# EasyEDA Pro project ProDocument_PCB2_2024-05-04.epro

# Board PCB2
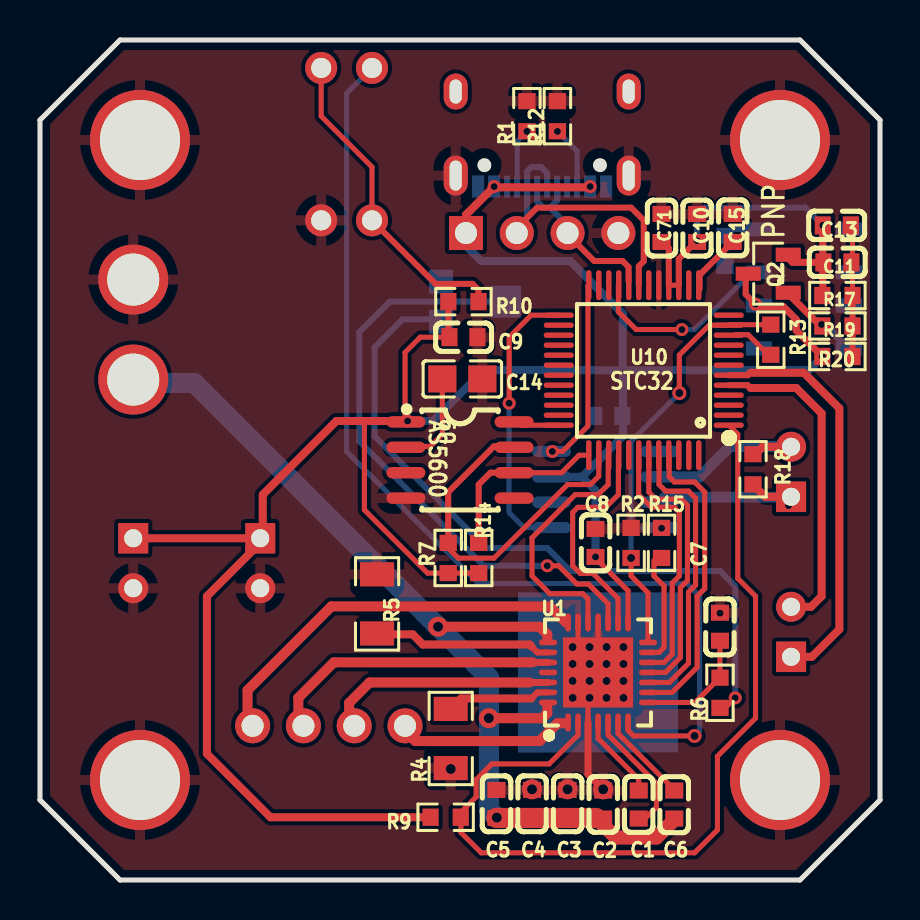
[diagram p0: board, top side]
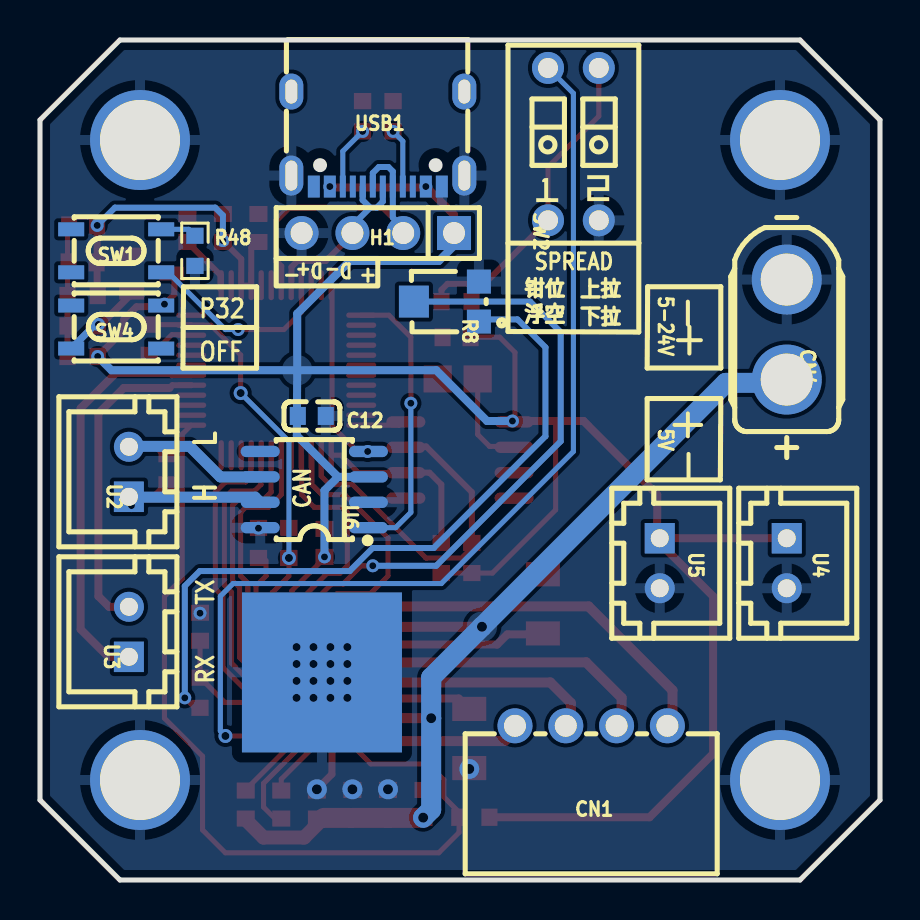
[diagram p1: board, bottom side, seen from below]

Outline 42 x 42 mm; copper layers: Top Layer, Bottom Layer. Coordinates in mm from the lower left corner of the outline.
Outline path: 0,38 0,4 4,0 38,0 42,4 42,38 38,42 4,42 0,38
Stack: Top Layer 0.035mm / Dielectric1 1.51mm FR4 er 4.5 / Bottom Layer 0.035mm

## Design rules (mm)
spacing safeClearance (default): track to track 0.152, other pairs 0.152 to 0.3
track width trackWidth (default): min 0.127, default 0.254, max 2.54
differential pair differentialPair (default): width min 0.127, default 0.254, max 2.54; gap min 0.152, default 0.152
via viaSize (default): diameter min 0.5, default 0.61, max 10; hole min 0.3, default 0.305, max 6

## Placement (name value [footprint] x y rotation side)
C1  22nF  [C0603]  29.94 3.77 270 top
C2  4.7uF  [C0603]  28.16 3.77 270 top
C3  4.7uF  [C0603]  26.38 3.8 270 top
C4  100nF  [C0603]  24.6 3.8 270 top
C5  100nF  [C0603]  22.82 3.8 270 top
C6  100nF  [C0603]  31.71 3.77 90 top
C7  4.7uF  [C0603]  34 12.66 90 top
C8  100nF  [C0603]  27.78 16.85 270 top
C9  100nF  [C0603]  21.17 27.14 180 top
C10  100nF  [C0603]  32.86 32.6 90 top
C11  22uF  [C0603]  39.87 30.88 0 top
C12  100nF  [C0603]  28.41 23.2 0 bottom
C13  0.1uF  [C0603]  39.84 32.73 0 top
C14  1uF  [C0805]  21.12 25.05 0 top
C15  10uF  [C0603]  34.63 32.6 270 top
C71  10uF  [C0603]  31.08 32.6 90 top
CN1  XH-4AW  [CONN-TH_XH-4AW]  14.44 7.71 180 bottom
CN4  XT30UPB-F30.G.Y  [CONN-TH_XT30UPB-F]  4.66 27.52 90 bottom
H1  PZ254V-11-04P  [HDR-TH_4P-P2.54-V-M]  25.11 32.35 0 bottom
NOREF  -  [Pad_e147]  37 37 180 top
NOREF#2  -  [Pad_e2045]  27.9 10.38 180 top
NOREF#3  -  [Pad_e149]  5 5 180 top
NOREF#4  -  [Pad_e150]  37 5 180 top
NOREF#5  -  [Pad_e148]  5 37 180 top
Q2  S8550  [SOT-23-3_L2.9-W1.3-P1.90-LS2.4-BR]  36.41 30.32 0 top
R1  5.1K  [R0603]  24.35 38.19 90 top
R2  10K  [R0603]  29.55 16.85 270 top
R4  0.1R  [R1206]  20.54 7.08 270 top
R5  0.1R  [R1206]  16.85 13.81 90 top
R6  10K  [R0603]  34 9.36 90 top
R7  10K  [R0603]  20.41 16.1 270 top
R8  10kΩ  [RES-ADJ-SMD_3P-L3.0-W3.8-P1.75-BR]  21.68 28.92 180 bottom
R9  10K  [R0603]  20.28 3.14 0 top
R10  10K  [R0603]  21.17 28.92 0 top
R12  5.1K  [R0603]  25.87 38.19 90 top
R13  1K  [R0603]  36.54 27.01 270 top
R14  10K  [R0603]  21.93 16.1 270 top
R15  10K  [R0603]  31.08 16.85 270 top
R17  1kΩ  [R0603]  39.87 29.22 180 top
R18  120Ω  [R0603]  35.65 20.54 270 top
R19  1kΩ  [R0603]  39.87 27.7 180 top
R20  5.1K  [R0603]  39.87 26.18 180 top
R48  1kΩ  [R0603]  34.25 31.46 90 bottom
SW1  TS-1089S-02526  [SW-SMD_4P-L4.2-W3.3-P2.15-LS5.1]  38.19 31.46 180 bottom
SW2  DS1040-02BN  [KEY-TH_DS1040-02BN]  15.33 36.79 180 bottom
SW4  TS-1089S-02526  [SW-SMD_4P-L4.2-W3.3-P2.15-LS5.1]  38.19 27.65 0 bottom
U1  TMC2209-LA  [QFN-28_L5.0-W5.0-P0.50-BL-EP]  27.9 10.38 0 top
U2  HC-XH-2A-G  [CONN-TH_2P-P2.50_HC-XH-2A-G]  37.56 20.41 90 bottom
U3  HC-XH-2A-G  [CONN-TH_2P-P2.50_HC-XH-2A-G]  37.56 12.41 90 bottom
U4  HC-XH-2A-G  [CONN-TH_2P-P2.50_HC-XH-2A-G]  4.66 15.84 270 bottom
U5  HC-XH-2A-G  [CONN-TH_2P-P2.50_HC-XH-2A-G]  11.01 15.84 270 bottom
U6  TJA1050T/CM,118  [SOIC-8_L5.0-W4.0-P1.27-LS6.0-BL]  28.28 19.52 90 bottom
U9  AS5600-ASOT  [SOIC-8_L5.0-W4.0-P1.27-LS6.0-BL]  21 21 270 top
U10  STC32G12K128-35I-LQFP48  [LQFP-48_L7.0-W7.0-P0.50-LS9.0-BL]  30.19 25.49 90 top
USB1  TYPE-C 16PIN 2MD(073)  [USB-C-SMD_TYPE-C-6PIN-2MD-073]  25.11 37.05 0 bottom

## Footprints (pads in the part's own frame, mm; a bottom-side part is the same pattern mirrored in y, then rotated)
C0603
  rect 0.8x0.9 smd: 1(-0.7,0) 2(0.7,0)
C0805
  rect 1.41x1.35 smd: 1(-1,0) 2(1,0)
CONN-TH_2P-P2.50_HC-XH-2A-G
  rect 1.524x1.5 hole 0.9: 1(-1.25,0)
  round 1.5 hole 0.9: 2(1.25,0)
CONN-TH_XH-4AW
  round 1.75 hole 1.1: 1(-3.81,0) 2(-1.27,0) 3(1.27,0) 4(3.81,0)
CONN-TH_XT30UPB-F
  round 3.5 hole 2.6: 1(-2.5,0) 2(2.5,0)
HDR-TH_4P-P2.54-V-M
  rect 1.7x1.7 hole 1.1: 1(-3.81,0)
  round 1.7 hole 1.1: 2(-1.27,0) 3(1.27,0) 4(3.81,0)
KEY-TH_DS1040-02BN
  round 1.6 hole 1: 1(-1.27,-3.81) 2(1.27,-3.81) 3(1.27,3.81) 4(-1.27,3.81)
LQFP-48_L7.0-W7.0-P0.50-LS9.0-BL
  oval 0.27x1.5 smd: 1(-2.75,-4.25) 2(-2.25,-4.25) 3(-1.75,-4.25) 4(-1.25,-4.25) 5(-0.75,-4.25) 6(-0.25,-4.25) 7(0.25,-4.25) 8(0.75,-4.25) 9(1.25,-4.25) 10(1.75,-4.25) 11(2.25,-4.25) 12(2.75,-4.25) 25(2.75,4.25) 26(2.25,4.25) 27(1.75,4.25) 28(1.25,4.25) 29(0.75,4.25) 30(0.25,4.25) 31(-0.25,4.25) 32(-0.75,4.25) 33(-1.25,4.25) 34(-1.75,4.25) 35(-2.25,4.25) 36(-2.75,4.25)
  oval 1.5x0.27 smd: 13(4.25,-2.75) 14(4.25,-2.25) 15(4.25,-1.75) 16(4.25,-1.25) 17(4.25,-0.75) 18(4.25,-0.25) 19(4.25,0.25) 20(4.25,0.75) 21(4.25,1.25) 22(4.25,1.75) 23(4.25,2.25) 24(4.25,2.75) 37(-4.25,2.75) 38(-4.25,2.25) 39(-4.25,1.75) 40(-4.25,1.25) 41(-4.25,0.75) 42(-4.25,0.25) 43(-4.25,-0.25) 44(-4.25,-0.75) 45(-4.25,-1.25) 46(-4.25,-1.75) 47(-4.25,-2.25) 48(-4.25,-2.75)
Pad_e147
  round 5 hole 4: 1(0,0)
Pad_e148
  round 5 hole 4: 2(0,0)
Pad_e149
  round 5 hole 4: 3(0,0)
Pad_e150
  round 5 hole 4: 4(0,0)
Pad_e2045
  rect 8x8 smd far side: 1(0,0)
QFN-28_L5.0-W5.0-P0.50-BL-EP
  oval 0.28x0.9 smd: 1(-1.502,-2.5) 2(-1.001,-2.5) 3(-0.5,-2.5) 4(0,-2.5) 5(0.5,-2.5) 6(1,-2.5) 7(1.501,-2.5) 15(1.501,2.5) 16(1,2.5) 17(0.5,2.5) 18(0,2.5) 19(-0.5,2.5) 20(-1.001,2.5) 21(-1.502,2.5)
  oval 0.9x0.28 smd: 8(2.5,-1.502) 9(2.5,-1.001) 10(2.5,-0.5) 11(2.5,0) 12(2.5,0.5) 13(2.5,1) 14(2.5,1.501) 22(-2.5,1.501) 23(-2.5,1) 24(-2.5,0.5) 25(-2.5,0) 26(-2.5,-0.5) 27(-2.5,-1.001) 28(-2.5,-1.502)
  rect 3.5x3.5 smd: 29(0,0)
R0603
  rect 0.806x0.864 smd: 1(-0.753,0) 2(0.753,0)
R1206
  rect 1.208x1.701 smd: 1(-1.479,0) 2(1.479,0)
RES-ADJ-SMD_3P-L3.0-W3.8-P1.75-BR
  rect 1.2x1.2 smd: 1(1.625,-1) 3(1.625,1)
  rect 1.5x1.6 smd: 2(-1.625,0)
SOIC-8_L5.0-W4.0-P1.27-LS6.0-BL
  oval 0.569x1.95 smd: 1(-1.905,-2.705) 2(-0.635,-2.705) 3(0.635,-2.705) 4(1.905,-2.705) 5(1.905,2.705) 6(0.635,2.705) 7(-0.635,2.705) 8(-1.905,2.705)
SOT-23-3_L2.9-W1.3-P1.90-LS2.4-BR
  rect 1.25x0.7 smd: 1(1,-0.95) 2(1,0.95) 3(-1,0)
SW-SMD_4P-L4.2-W3.3-P2.15-LS5.1
  rect 1.3x0.7 smd: 1(-2.25,1.075) 2(2.25,1.075) 3(-2.25,-1.075) 4(2.25,-1.075)
USB-C-SMD_TYPE-C-6PIN-2MD-073
  rect 0.6x1.1 smd: 1(-3.2,2.375) 2(-2.4,2.375) 11(2.4,2.375) 12(3.2,2.375)
  rect 0.3x1.1 smd: 3(-1.75,2.375) 4(-1.25,2.375) 5(-0.75,2.375) 6(-0.25,2.375) 7(0.25,2.375) 8(0.75,2.375) 9(1.25,2.375) 10(1.75,2.375)
  oval 1.2x1.8 hole 0.6x1.2: 13(-4.325,-2.375) 14(4.325,-2.375)
  oval 1.2x2 hole 0.6x1.5: 13(-4.325,1.825) 14(4.325,1.825)

## Nets
5V: C8.2 C9.2 C12.2 H1.1 Q2.3 R7.2 R9.1 R10.1 R14.2 R20.2 SW4.3 U1.15 U4.1 U5.1 U6.3 U9.1 USB1.2 USB1.11
5VOUT: C7.1 R6.2 U1.8
GND: C2.1 C3.1 C4.1 C5.1 C7.2 C8.1 C9.1 C10.2 C12.1 C14.2 C15.1 C71.2 CN4.2 H1.4 NOREF.1 NOREF#2.1 NOREF#3.3 NOREF#4.4 NOREF#5.2 R1.2 R2.1 R4.2 R5.2 R8.3 R12.2 R15.1 R48.1 SW2.2 U1.3 U1.18 U1.20 U1.29 U4.2 U5.2 U6.2 U6.8 U9.4 U10.17 USB1.1 USB1.12 USB1.13 USB1.14
A1: CN1.3 U1.24
A2: CN1.4 U1.21
AS5600_DIR: U9.8 U10.36
AS5600_SCL: R7.1 U9.7 U10.38
AS5600_SDA: R14.1 U9.6 U10.37
B1: CN1.2 U1.26
B2: CN1.1 U1.1
CANH: R18.2 U2.1 U6.7
CANL: R18.1 U2.2 U6.6
CANRX: U6.4 U10.24
CANTX: U6.1 U10.25
D+: H1.3 U10.20 USB1.6 USB1.8
D-: H1.2 U10.19 USB1.5 USB1.7
DIAG: U1.11 U10.43
DIR: U1.19 U10.39
EN: R9.2 U1.2 U10.1
INDEX: U1.12 U10.42
MS1: U1.9 U10.45
MS2: U1.10 U10.44
SPREAD: SW2.4 U1.7
STC_VCC: C10.1 C11.1 C13.1 C71.1 Q2.2 R17.2 U10.15 U10.16
STEP: U1.16 U10.40
TMC2209_RX: R2.2 R13.1 U1.14 U10.11
TMC2209_TX: R13.2 U10.10
UART2_RX: U3.2 U10.5
UART2_TX: U3.1 U10.6
VCP: C6.2 U1.6
VM: C2.2 C3.2 C4.2 C5.2 C6.1 CN4.1 U1.22 U1.28
$1N1664: R4.1 U1.27
$1N1667: R5.1 U1.23
$1N1679: R6.1 R8.1
$1N1684: C1.1 U1.4
$1N1687: C1.2 U1.5
$1N1724: R15.2 U1.13
$1N1728: R8.2 U1.17
$1N7809: R10.2 SW2.1 SW2.3
$1N13583: R1.1 USB1.4
$1N13638: R12.1 USB1.10
$1N18653: R48.2 SW1.2
$1N20613: Q2.1 R19.2 SW4.2
$1N20840: C11.2 C13.2 R17.1 R19.1 R20.1
$1N22704: C14.1 U9.2
$1N38726: C15.2 U10.13
$1N69835: SW1.4 U10.21

Pads without a net: SW1 1 3; SW4 1 4; U1 25; U6 5; U9 3 5; U10 2 3 4 7 8 9 12 14 18 22 23 26 27 28 29 30 31 32 33 34 35 41 46 47 48; USB1 3 9

## Via types
v1: diameter 0.7, hole 0.4, Top Layer to Bottom Layer, 19 vias
v2: diameter 0.65, hole 0.35, Top Layer to Bottom Layer, 19 vias
v3: diameter 1, hole 0.5, Top Layer to Bottom Layer, 7 vias

## Routing (per net, layer and track width the routed paths; a pad name or vN(x,y) marks a point on that pad's centre or on a via; arc(x,y) is an arc through that point)
5V: length 126.2
  Top Layer w0.254: v2(27.78,16.15) 27.71,16.09 27.78,16.09 29.4,14.46 U1.15 ; 20.41,15.33 20.43,15.35 R14.2 ; 18.25,22.91 18.25,26.38 19.01,27.14 C9.2 ; R7.2 19.38,15.35 16.22,18.5 16.22,22.95
  Top Layer w0.3: 35.29,30.32 35.29,29.28 v2(35.78,28.79) ; R10.1 20.42,27.19 C9.2
  Top Layer w0.35: v2(39.12,26.18) 37.81,27.48 37.81,28.03 37.17,28.67 35.9,28.67 v2(35.78,28.79)
  Top Layer w0.4: H1.1 21.3,33.26 v2(22.71,34.67) 22.75,34.63 27.47,34.63 v2(27.51,34.67) ; 11.14,16.98 11.03,17.09 U4.1 ; 11.14,16.98 11.14,19.27 14.82,22.95 v2(18.38,22.95) ; 11.14,16.98 8.35,14.19 8.35,6.31 11.52,3.14 R9.1
  Bottom Layer w0.4: v2(18.38,22.95) 19.65,22.95 22.19,25.49 29.14,25.49 ; 29.14,25.49 38.43,25.49 v2(39.12,26.18) ; 29.14,25.49 29.14,28.32 26.51,30.95 22.06,30.95 21.3,31.71 H1.1 ; 29.14,25.49 29.16,22.22 27.1,20.16 ; U6.3 27.1,20.16 ; 27.1,20.16 27.78,19.48 v2(27.78,16.15)
5VOUT: length 6
  Top Layer w0.254: C7.1 34,10.12 32.75,8.88 U1.8
GND: length 11.7
  Top Layer w0.254: 27.9,10.42 27.9,10.25 27.4,9.75 U1.3 ; 27.9,10.42 U1.18 ; 27.9,10.42 26.9,11.42 U1.20
  Top Layer w0.35: v3(28.16,4.53) 27.4,5.29 U1.3
  vias: v1(26.63,11.65) v1(26.63,10.8) v1(26.63,9.95) v1(26.63,9.11) v1(27.48,11.65) v1(27.48,10.8) v1(27.48,9.95) v1(27.48,9.11) v1(28.33,11.65) v1(28.33,10.8) v1(28.33,9.95) v1(28.33,9.11) v1(29.17,11.65) v1(29.17,10.8) v1(29.17,9.95) v1(29.17,9.11) v2(31.08,17.59) v2(34,13.34) v3(20.54,5.55) v3(24.6,4.53) v3(26.38,4.53)
A1: length 14.4
  Top Layer w0.35: U1.24 24.86,10.88
  Top Layer w0.5: 12.92,7.71 12.92,9.11 14.7,10.89 24.62,10.89
A2: length 19.8
  Top Layer w0.5: 26.29,12.88 25.49,13.68 14.57,13.68 10.38,9.49 10.38,7.71
AS5600_DIR: length 2.2
  Top Layer w0.254: U10.36 24.05,22.74 23.84,22.95
AS5600_SCL: length 17.5
  Top Layer w0.254: U10.38 27.94,20.19 27.52,19.78 26.38,19.78 22.7,16.09 20.92,16.09 20.41,16.6 R7.1
  Top Layer w0.3: R7.1 20.41,19.39 22.7,21.68 23.66,21.68 U9.7
AS5600_SDA: length 9
  Top Layer w0.254: 23.81,20.36 26.08,20.36 26.96,21.24 U10.37
  Top Layer w0.3: 23.81,20.36 22.52,20.36 21.93,19.78 R14.1
B1: length 11.5
  Top Layer w0.35: U1.26 24.47,9.88
  Top Layer w0.5: 24.47,9.88 16.48,9.88 15.46,8.85 15.46,7.71
B2: length 9
  Top Layer w0.35: 26.29,7.88 26.25,7.84
  Top Layer w0.5: 18,7.71 18.76,6.95 24.98,6.95 25.87,7.84 26.25,7.84
CANH: length 8.8
  Top Layer w0.4: 35.65,19.78 36.27,19.16 U2.1
  Bottom Layer w0.55: 30.99,18.89 31.24,19.14 37.54,19.14 U2.1
  vias: v2(37.43,18.72)
CANL: length 9.1
  Top Layer w0.4: 35.78,21.3 36.14,21.66 U2.2
  Bottom Layer w0.55: U2.2 37.54,21.68 34.51,21.68 32.98,20.16 30.99,20.16
CANRX: length 9.4
  Top Layer w0.254: U10.24 27.4,29.7 27.4,22.7 26.12,21.43 v2(25.62,21.43)
CANTX: length 14.1
  Top Layer w0.254: U10.25 24.56,28.24 23.46,27.14 v2(23.46,23.84)
  Bottom Layer w0.254: v2(23.46,23.84) 23.46,18.38 24.22,17.62 U6.1
D+: length 8.8
  Top Layer w0.3: 29.43,29.94 29.43,30.65 29.13,30.95 27.71,30.95 26.38,32.28 H1.3
  Bottom Layer w0.3: 25.49,33.62 25.87,34 25.87,34.63 ; 25.49,33.62 25.16,33.62 24.86,33.92 USB1.6 ; 25.49,33.62 26.38,32.73 H1.3
D-: length 15.8
  Top Layer w0.3: U10.19 29.94,30.69 30.19,30.94 30.19,32.98 29.55,33.62 24.86,33.62 23.84,32.6 23.84,32.35
  Bottom Layer w0.3: USB1.7 25.36,35.35 25.06,35.65 24.58,35.65 24.36,35.43 USB1.5 24.36,33.12 23.84,32.6 23.84,32.35
DIAG: length 13.7
  Top Layer w0.254: U1.11 31.27,10.38 32.02,11.12 32.02,14.62 32.37,14.97 32.37,18.73 32.07,19.04 30.8,19.04 30.44,19.39 30.44,21.24 U10.43
DIR: length 12.6
  Top Layer w0.254: U10.39 28.41,21.21 28.41,19.78 27.9,19.27 26.76,19.27 24.6,17.11 24.6,15.2 25.49,14.31 27.14,14.31 27.4,14.06 27.4,13.04
EN: length 44.9
  Top Layer w0.254: U10.1 34.89,22.29 34.89,15.08 35.78,14.19 35.78,8.09 33.87,6.19 33.87,2.5 32.73,1.36 22.06,1.36 21.05,2.38 21.05,3.13 ; 21.05,3.13 R9.2 ; 21.05,3.13 21.05,3.39 21.81,4.15 21.81,5.02 22.6,5.81 25.46,5.81 26.9,7.25 U1.2
INDEX: length 13
  Top Layer w0.254: U10.42 29.94,21.24 29.94,19.27 30.57,18.63 31.71,18.63 31.97,18.38 31.97,15.2 31.61,14.85 31.61,11.29 31.2,10.88 U1.12
MS1: length 15.1
  Top Layer w0.254: U1.9 31.6,9.38 32.86,10.63 32.86,14.19 33.24,14.57 33.24,19.39 32.73,19.9 31.71,19.9 31.46,20.16 31.46,21.22 U10.45
MS2: length 14.4
  Top Layer w0.254: U10.44 30.95,21.23 30.95,19.78 31.28,19.44 32.42,19.44 32.78,19.09 32.78,14.75 32.42,14.39 32.42,10.83 31.47,9.88 U1.10
SPREAD: length 51.3
  Top Layer w0.254: U1.7 29.4,7.48 29.68,7.2 v1(32.73,7.2)
  Bottom Layer w0.254: SW2.4 15.33,39.33 15.33,21.43 21.93,14.82 32.35,14.82 32.98,14.19 32.98,7.46 v1(32.73,7.2)
STC_VCC: length 19.1
  Top Layer w0.254: U10.16 U10.15
  Top Layer w0.3: v2(32.86,31.97) 31.94,31.05 U10.15 ; 31.08,31.97 31.44,31.61 U10.16
  Top Layer w0.35: v2(39.14,32.73) 39.14,30.88 ; 39.14,30.88 37.63,30.88 37.3,31.2 ; 39.14,30.88 39.14,29.23 39.08,29.17
  Bottom Layer w0.3: v2(39.14,32.73) 38.25,33.62 33.24,33.62 32.86,33.24 v2(32.86,31.97)
STEP: length 11.4
  Top Layer w0.254: U10.40 28.92,21.22 28.92,19.27 28.28,18.63 26.89,18.63 26.63,18.38 26.63,15.71 27.01,15.33 27.65,15.33 28.9,14.08 U1.16
TMC2209_RX: length 20.8
  Top Layer w0.254: v1(31.97,24.35) 31.97,26.25 33.46,27.74 U10.11 34.47,27.77 36.41,27.77 ; U1.14 30.4,14.35 29.55,15.2 v1(29.55,16.1)
  Bottom Layer w0.254: v1(29.55,16.1) 29.55,21.93 v1(31.97,24.35)
TMC2209_TX: length 2.1
  Top Layer w0.254: 34.76,27.27 35.4,27.27 36.41,26.26
UART2_RX: length 16.1
  Top Layer w0.3: 35.52,24.6 35.38,24.74 U10.5
  Top Layer w0.4: 35.52,24.6 37.81,24.6 39.08,23.33 39.08,14.19 38.55,13.66 U3.2
UART2_TX: length 20.3
  Top Layer w0.3: U10.6 35.4,25.24 35.52,25.36
  Top Layer w0.4: 35.52,25.36 38.19,25.36 39.97,23.58 39.97,12.54 38.59,11.16 U3.1
VCP: length 4.5
  Top Layer w0.254: 31.71,4.52 28.9,7.32 U1.6
VM: length 50.2
  Top Layer w0.35: 25.36,8.84 25.36,8.73 ; 25.36,11.92 25.36,12.03
  Top Layer w0.5: 25.36,12.03 25.36,12.28 24.98,12.66 v3(19.9,12.66) ; v3(22.44,8.09) 25.11,8.09 25.36,8.34 25.36,8.73
  Top Layer w0.7: 27.81,3.1 28.79,2.12 30.82,2.12 31.78,3.07
  Top Layer w1: C3.2 C4.2 C5.2 ; 26.51,3.1 27.81,3.1
  Bottom Layer w1: v3(22.84,3.12) 22.44,3.52 v3(22.44,8.09) 22.44,10.12 v3(19.9,12.66) 7.71,24.86 4.83,24.86 CN4.1
$1N1664: length 5.2
  Top Layer w0.3: 24.57,9.08 24.87,9.38 U1.27
  Top Layer w0.4: 24.57,9.08 21.06,9.08 R4.1
$1N1667: length 8.9
  Top Layer w0.3: 24.57,11.68 24.87,11.38 U1.23
  Top Layer w0.4: 24.57,11.68 24.47,11.77 19.14,11.77 18.63,12.28 16.9,12.28 R5.1
$1N1679: length 36.1
  Top Layer w0.254: R6.1 34.26,8.61 v2(34.76,9.11)
  Bottom Layer w0.3: R8.1 19.94,28.03 18.12,28.03 16.73,26.63 16.73,22.19 22.32,16.6 25.36,16.6 26.52,15.45 34.01,15.45 34.76,14.69 v2(34.76,9.11)
$1N1684: length 4.3
  Top Layer w0.254: 27.9,7.96 27.9,7.08 29.94,5.04 C1.1
$1N1687: length 6.4
  Top Layer w0.254: U1.5 28.4,7.25 30.82,4.83 30.82,3.65 30.25,3.07 C1.2
$1N1724: length 5.5
  Top Layer w0.254: 30.7,15.97 30.7,15.2 31.21,14.69 31.21,11.63 30.95,11.38 U1.13
$1N1728: length 30.2
  Top Layer w0.254: U1.17 28.4,13.81 27.42,14.8 26.85,14.8 25.93,15.71 v2(25.36,15.71)
  Bottom Layer w0.3: v2(25.36,15.71) 22.19,15.71 15.97,21.93 15.97,27.39 17.49,28.92 R8.2
$1N7809: length 16
  Top Layer w0.254: SW2.1 16.6,35.65 14.06,38.19 SW2.3
  Top Layer w0.3: R10.2 21.93,29.51 21.63,29.81 19.78,29.81 SW2.1
$1N13583: length 3
  Bottom Layer w0.254: v2(24.35,37.43) 23.86,36.94 USB1.4
$1N13638: length 3.2
  Bottom Layer w0.254: v2(25.87,37.43) 26.86,36.44 USB1.10
$1N18653: length 1.8
  Bottom Layer w0.254: SW1.2 34.57,32.53 34.25,32.22
$1N20613: length 4.5
  Top Layer w0.254: R19.2 39.08,27.74 v2(39.08,27.78)
  Top Layer w0.35: R19.2 39.03,27.7 37.3,29.43
  Bottom Layer w0.35: SW4.2 39.24,27.78 v2(39.08,27.78)
$1N20840: length 6.6
  Top Layer w0.254: C13.2 40.62,32.65 R17.1
  Top Layer w0.3: R17.1 R19.1 R20.1
$1N22704: length 4.8
  Top Layer w0.254: 18.38,21.68 19.52,21.68 20.12,22.28 C14.1
$1N38726: length 3
  Top Layer w0.3: C15.2 32.98,30.25 32.98,29.55
$1N69835: length 9.9
  Top Layer w0.254: v2(32.09,27.52) 29.81,27.52 28.92,28.41 28.92,29.72 U10.21
  Bottom Layer w0.254: SW1.4 35.59,30.38 32.73,27.52 v2(32.09,27.52)

## Copper pours and planes (outline as drawn; the poured copper is in the pictures)
5V on Bottom Layer: 29.9,25.56 29.87,25.71 29.81,25.85 29.73,25.97 29.62,26.08 29.5,26.16 29.36,26.22 29.21,26.25 29.07,26.25 28.92,26.22 28.78,26.16 28.66,26.08 28.55,25.97 28.47,25.85 28.41,25.71 28.38,25.56 28.38,25.42 28.41,25.27 28.47,25.13 28.55,25.01 28.66,24.9 28.78,24.82 28.92,24.76 29.07,24.73 29.21,24.73 29.36,24.76 29.5,24.82 29.62,24.9 29.73,25.01 29.81,25.13 29.87,25.27 29.9,25.42
GND on Top Layer: -0.54,45.3 45.81,45.3 45.81,-0.16 -0.54,-0.16
GND on Bottom Layer: -2.45,43.4 44.29,43.4 44.29,-2.32 -2.45,-2.32
VM on Bottom Layer: 20.66,12.74 20.63,12.88 20.57,13.02 20.49,13.15 20.39,13.25 20.26,13.34 20.12,13.39 19.98,13.42 19.83,13.42 19.68,13.39 19.54,13.34 19.42,13.25 19.31,13.15 19.23,13.02 19.17,12.88 19.14,12.74 19.14,12.59 19.17,12.44 19.23,12.3 19.31,12.18 19.42,12.07 19.54,11.99 19.68,11.93 19.83,11.9 19.98,11.9 20.12,11.93 20.26,11.99 20.39,12.07 20.49,12.18 20.57,12.3 20.63,12.44 20.66,12.59

## Text on the board
Bottom Silkscreen Layer: 5-24V | 5V | D- | D+ | SPREAD | + | - | CAN | TX | RX | P32 | OFF | L | H | 上拉 | 下拉 | 钳位 | 浮空
Top Silkscreen Layer: AS5600 | STC32 | PNP
